# EAGLE design board (EAGLE 5.06)
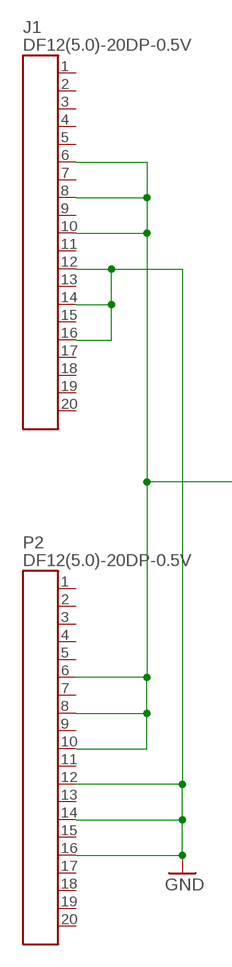
[diagram p0: schematic, sheet 1, part 1 of 2]
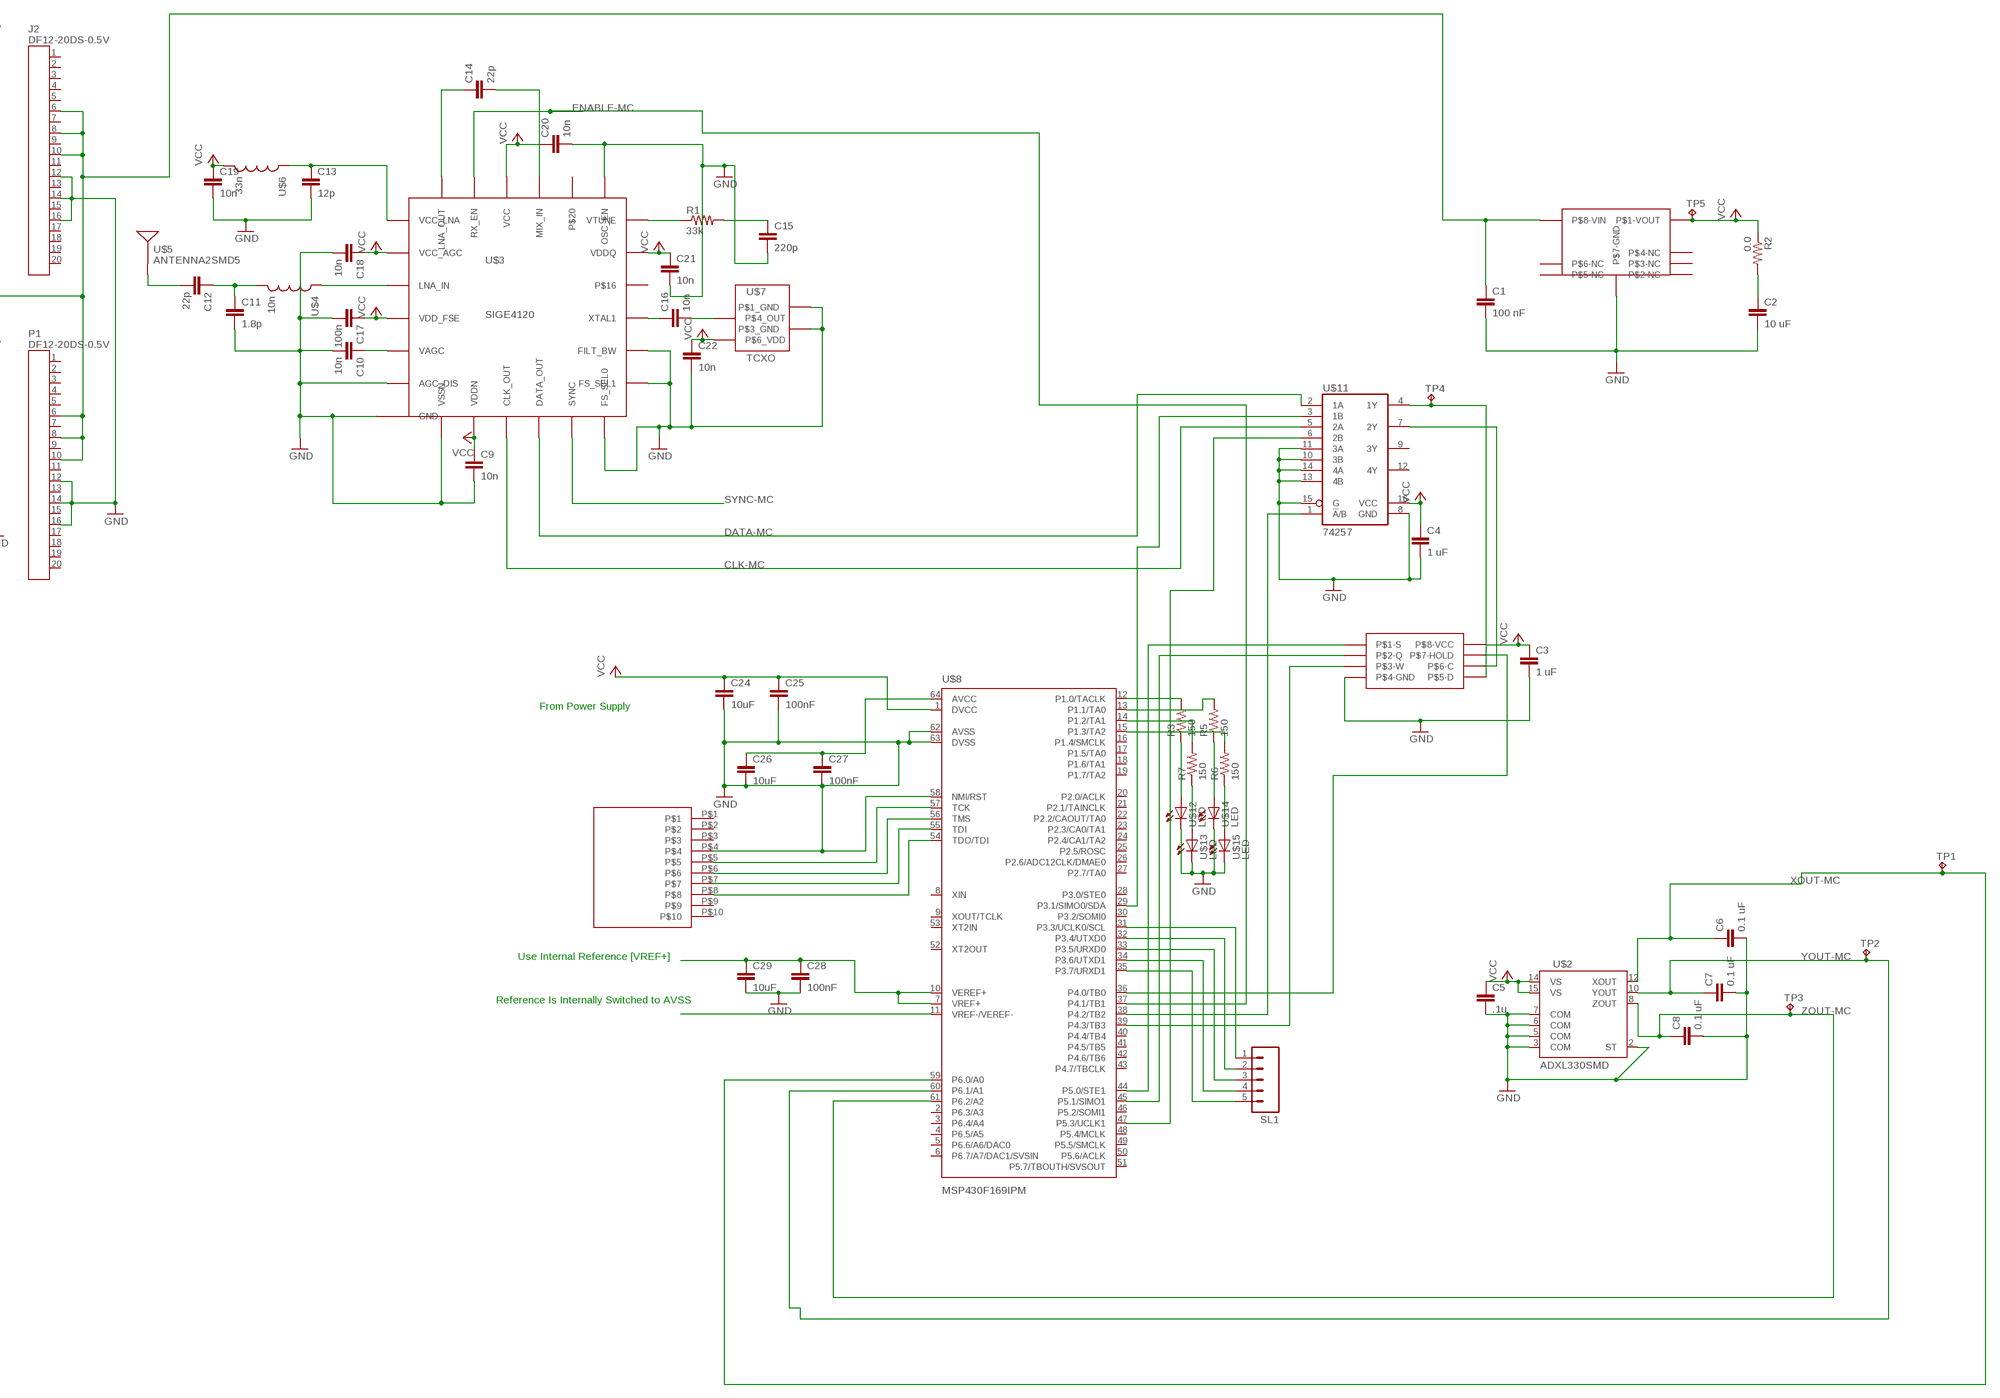
[diagram p1: schematic, sheet 1, part 2 of 2]

## Parts
C1  100 nF  CAP0402  [C0402]
C2  10 uF  CAP0402  [C0402]
C3  1 uF  CAP0402  [C0402]
C4  1 uF  CAP0402  [C0402]
C5  .1u  CAP0402  [C0402]
C6  0.1 uF  CAP0402  [C0402]
C7  0.1 uF  CAP0402  [C0402]
C8  0.1 uF  CAP0402  [C0402]
C9  10n  CAP0402  [C0402]
C10  10n  CAP0402  [C0402]
C11  1.8p  CAP0402  [C0402]
C12  22p  CAP0402  [C0402]
C13  12p  CAP0402  [C0402]
C14  22p  CAP0402  [C0402]
C15  220p  CAP0402  [C0402]
C16  10n  CAP0402  [C0402]
C17  100n  CAP0402  [C0402]
C18  10n  CAP0402  [C0402]
C19  10n  CAP0402  [C0402]
C20  10n  CAP0402  [C0402]
C21  10n  CAP0402  [C0402]
C22  10n  CAP0402  [C0402]
C24  10uF  CAP0402  [C0402]
C25  100nF  CAP0402  [C0402]
C26  10uF  CAP0402  [C0402]
C27  100nF  CAP0402  [C0402]
C28  100nF  CAP0402  [C0402]
C29  10uF  CAP0402  [C0402]
J1  DF12(5.0)-20DP-0.5V  [DF12(XX)-20DP-0.5V]
J2  DF12-20DS-0.5V  [DF12-20DS-0.5V]
P1  DF12-20DS-0.5V  [DF12-20DS-0.5V]
P2  DF12(5.0)-20DP-0.5V  [DF12(XX)-20DP-0.5V]
R1  33k  RESISTOR0402  [C0402]
R2  0.0  RESISTOR  [0805]
R3  150  RESISTOR0402  [C0402]
R5  150  RESISTOR0402  [C0402]
R6  150  RESISTOR0402  [C0402]
R7  150  RESISTOR0402  [C0402]
SL1  M05  [1X05]
TP1  TPTP09SQ  [TP09SQ]
TP2  TPTP09SQ  [TP09SQ]
TP3  TPTP09SQ  [TP09SQ]
TP4  TPTP09SQ  [TP09SQ]
TP5  TPTP09SQ  [TP09SQ]
U$1  FH12A-10S-0.5SH(55)  [FH12A-10S-0.5SH(55)]
U$2  ADXL330SMD  [LFCSP-16]
U$3  SIGE4120  [SIGE4120]
U$4  10n  INDUCTOR0402  [C0402]
U$5  ANTENNA2SMD5  [ANTENNA-CHIP5]
U$6  33n  INDUCTOR0402  [C0402]
U$7  TCXO  [TXCO]
U$8  MSP430F169IPM  [S-PQFP64-G64]
U$9  M25P128  [VDFPN8]
U$10  LM2936  [8-SOIC]
U$11  74257  [16]
U$12  LED  [LED0402]
U$13  LED  [LED0402]
U$14  LED  [LED0402]
U$15  LED  [LED0402]

## Nets
CLK-MC: U$3.CLK_OUT U$11.5(2A)
DATA-MC: U$3.DATA_OUT U$11.2(1A)
ENABLE-MC: U$3.RX_EN U$8.37(P4.1/TB1)
GND: C1.2 C2.2 C3.2 C4.2 C5.2 C6.2 C7.2 C8.2 C9.2 C10.2 C11.2 C13.2 C15.2 C17.2 C18.2 C19.2 C20.2 C21.2 C22.2 C24.2 C25.2 C26.2 C27.2 C28.2 C29.2 J1.12 J1.14 J1.16 J2.12 J2.14 J2.16 P1.12 P1.14 P1.16 P2.12 P2.14 P2.16 U$1.P$4 U$2.2(ST) U$2.3(COM) U$2.5(COM) U$2.6(COM) U$2.7(COM) U$3.AGC_DIS U$3.FILT_BW U$3.FS_SEL0 U$3.FS_SEL1 U$3.GND U$3.OSC_EN U$3.VSSN U$7.P$1_GND U$7.P$3_GND U$8.58(NMI/RST) U$8.62(AVSS) U$8.63(DVSS) U$9.P$4(P$4-GND) U$10.P$7-GND U$11.8(GND) U$11.10(3B) U$11.11(3A) U$11.13(4B) U$11.14(4A) U$11.15(G) U$12.P$2 U$13.P$2 U$14.P$2 U$15.P$2
N$1: U$8.36(P4.0/TB0) U$9.P$7(P$7-HOLD)
N$2: C28.1 C29.1 U$8.7(VREF+) U$8.10(VEREF+)
N$3: U$1.P$8 U$8.54(TDO/TDI)
N$4: SL1.1 U$8.31(P3.3/UCLK0/SCL)
N$5: C10.1 U$3.VAGC
N$6: SL1.2 U$8.32(P3.4/UTXD0)
N$7: U$3.LNA_IN U$4.1
N$8: C11.1 C12.1 U$4.2
N$9: C12.2 U$5.FEED(SIGNAL)
N$10: C13.1 U$3.VCC_LNA U$6.1
N$11: C14.1 U$3.LNA_OUT
N$12: C14.2 U$3.MIX_IN
N$13: R1.1 U$3.VTUNE
N$14: C15.1 R1.2
N$15: C16.1 U$3.XTAL1
N$16: C16.2 U$7.P$4_OUTPUT(P$4_OUT)
N$17: C1.1 J1.6 J1.8 J1.10 J2.6 J2.8 J2.10 P1.6 P1.8 P1.10 P2.6 P2.8 P2.10 U$10.P$8-VIN
N$18: C2.1 R2.2
N$19: U$8.11(VREF-/VEREF-)
N$20: SL1.3 U$8.33(P3.5/URXD0)
N$21: C26.1 C27.1 U$8.64(AVCC)
N$22: SL1.4 U$8.34(P3.6/UTXD1)
N$23: SL1.5 U$8.35(P3.7/URXD1)
N$24: U$8.45(P5.1/SIMO1) U$9.P$2(P$2-Q)
N$25: U$8.44(P5.0/STE1) U$9.P$1(P$1-S)
N$26: U$8.38(P4.2/TB2) U$11.1(!A!/B)
N$27: U$9.P$6(P$6-C) U$11.7(2Y)
N$28: TP4.TP U$9.P$5(P$5-D) U$11.4(1Y)
N$29: U$8.47(P5.3/UCLK1) U$11.6(2B)
N$30: U$8.29(P3.1/SIMO0/SDA) U$11.3(1B)
N$31: U$1.P$7 U$8.55(TDI)
N$32: U$1.P$6 U$8.56(TMS)
N$33: U$1.P$5 U$8.57(TCK)
N$34: U$8.39(P4.3/TB3) U$9.P$3(P$3-W)
N$35: R3.2 U$8.12(P1.0/TACLK)
N$37: R3.1 U$12.P$1
N$38: R5.2 U$8.13(P1.1/TA0)
N$39: R5.1 U$14.P$1
N$40: R7.2 U$8.14(P1.2/TA1)
N$41: R7.1 U$13.P$1
N$42: R6.2 U$8.15(P1.3/TA2)
N$43: R6.1 U$15.P$1
SYNC-MC: U$3.SYNC
VCC: C3.1 C4.1 C5.1 C9.1 C17.1 C18.1 C19.1 C20.1 C21.1 C22.1 C24.1 C25.1 R2.1 TP5.TP U$2.14(VS) U$2.15(VS) U$3.VCC U$3.VCC_AGC U$3.VDD_FSE U$3.VDDN U$3.VDDQ U$6.2 U$7.P$6_VDD U$8.1(DVCC) U$9.P$8(P$8-VCC) U$10.P$1-VOUT U$11.16(VCC)
XOUT-MC: C6.1 TP1.TP U$2.12(XOUT) U$8.59(P6.0/A0)
YOUT-MC: C7.1 TP2.TP U$2.10(YOUT) U$8.60(P6.1/A1)
ZOUT-MC: C8.1 TP3.TP U$2.8(ZOUT) U$8.61(P6.2/A2)
Unconnected: J1.1 J1.2 J1.3 J1.4 J1.5 J1.7 J1.9 J1.11 J1.13 J1.15 J1.17 J1.18 J1.19 J1.20 J2.1 J2.2 J2.3 J2.4 J2.5 J2.7 J2.9 J2.11 J2.13 J2.15 J2.17 J2.18 J2.19 J2.20 P1.1 P1.2 P1.3 P1.4 P1.5 P1.7 P1.9 P1.11 P1.13 P1.15 P1.17 P1.18 P1.19 P1.20 P2.1 P2.2 P2.3 P2.4 P2.5 P2.7 P2.9 P2.11 P2.13 P2.15 P2.17 P2.18 P2.19 P2.20 U$1.P$1 U$1.P$2 U$1.P$3 U$1.P$9 U$1.P$10 U$3.P$16 U$3.P$20 U$8.2(P6.3/A3) U$8.3(P6.4/A4) U$8.4(P6.5/A5) U$8.5(P6.6/A6/DAC0) U$8.6(P6.7/A7/DAC1/SVSIN) U$8.8(XIN) U$8.9(XOUT/TCLK) U$8.16(P1.4/SMCLK) U$8.17(P1.5/TA0) U$8.18(P1.6/TA1) U$8.19(P1.7/TA2) U$8.20(P2.0/ACLK) U$8.21(P2.1/TAINCLK) U$8.22(P2.2/CAOUT/TA0) U$8.23(P2.3/CA0/TA1) U$8.24(P2.4/CA1/TA2) U$8.25(P2.5/ROSC) U$8.26(P2.6/ADC12CLK/DMAE0) U$8.27(P2.7/TA0) U$8.28(P3.0/STE0) U$8.30(P3.2/SOMI0) U$8.40(P4.4/TB4) U$8.41(P4.5/TB5) U$8.42(P4.6/TB6) U$8.43(P4.7/TBCLK) U$8.46(P5.2/SOMI1) U$8.48(P5.4/MCLK) U$8.49(P5.5/SMCLK) U$8.50(P5.6/ACLK) U$8.51(P5.7/TBOUTH/SVSOUT) U$8.52(XT2OUT) U$8.53(XT2IN) U$10.P$2-NC U$10.P$3-NC U$10.P$4-NC U$10.P$5-NC U$10.P$6-NC U$11.9(3Y) U$11.12(4Y)

## Notes on the sheet
- From Power Supply
- Use Internal Reference [VREF+]
- Reference Is Internally Switched to AVSS

## Library data of the parts
C1-C22 C24-C29 = SparkFun:CAP: Capacitor Standard 0603 ceramic capacitor, and 0.1" leaded capacitor.
J1 P2 = Hirose Connectors:DF12(5.0)-20DP-0.5V: Connector, Header, board-board, 20-pin. Dual Row, 5mm stack height, 0.5mm Pitch (Hirose)
J2 P1 = Hirose Connectors:DF12-20DS-0.5V: Connector, Receptacle, board-board, 20-pin. Dual Row, 3.5 to 5mm stack height, 0.5mm Pitch (Hirose)
R1-R3 R5-R7 = SparkFun:RESISTOR: Resistor Basic schematic elements and footprints for 0603, 1206, and PTH 1/10th watt (small) resistors.
SL1 = SparkFun-3-2-07:M05: Header 5 Standard 5-pin 0.1" header. Use with straight break away headers (SKU : PType-HD), right angle break away headers (PType-HD-RightAngle), swiss pins (PType-30F), machine pins (PType-MP), and female headers (PType-FH). Molex polarized connector foot print use with SKU : Con-Hdr with associated crimp pins and housings.
TP1-TP5 = testpad:TP: Test pad
U$1 = mylib:FH12A-10S-0.5SH(55)
U$2 = SparkFun:ADXL330: Triple Axis Accelerometer Analog Devices ADXL330 +/-3g 2.4V-5.25V Analog output. Spark Fun Electronics SKU : COM-00730. Center pad paste layer has been reduced to avoid shorting.
U$3 = mylib:SIGE4120
U$4 U$6 = SparkFun:INDUCTOR: Inductors Basic Inductor/Choke - 0603 and 1206. Footprints are not proven and vary greatly between part numbers.
U$5 = SparkFun:ANTENNA2: Antenna Single endded antenna. Common with smaller chip antennas. CHIP4 package is the GPS Chip Antenna SKU: GPS-08418. CHIP5 package is 2.4GHz chip antenna SKU: WRL-00144.
U$7 = mylib:TCXO
U$8 = msp430:MSP430F16*: Mixed Signal Microcontroller 12bit ADC, 12bit DAC, I²C, USART, no LCD
U$9 = mylib:M25P128
U$10 = lm2936a:LM2936
U$11 = mylib:74257
U$12-U$15 = mylib:LED

## Board
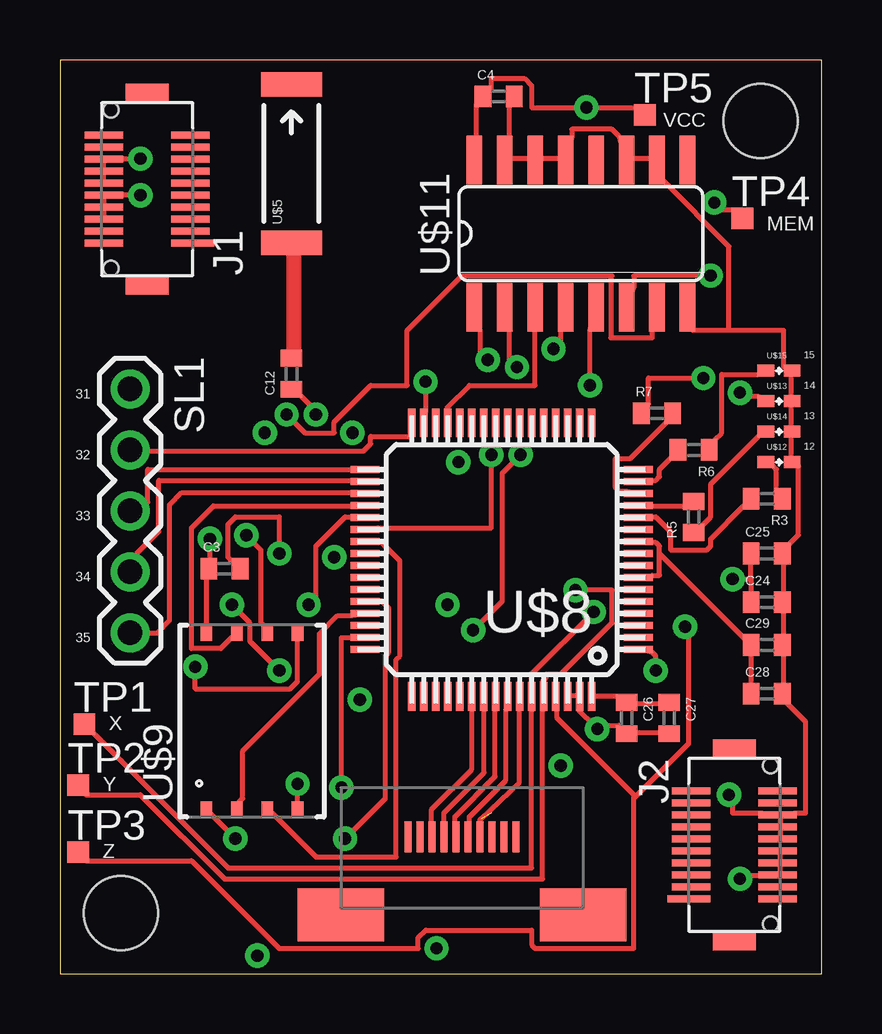
[diagram p2: board, top side]
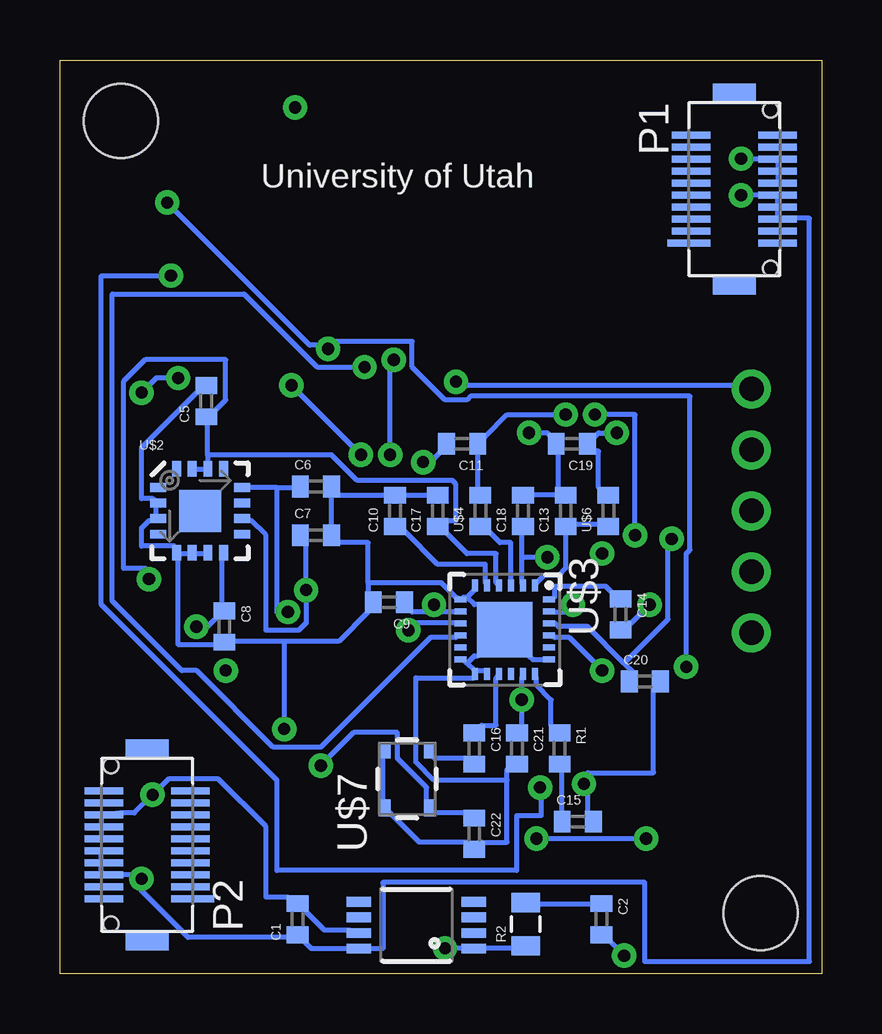
[diagram p3: board, bottom side, seen from below]

Size 31.75 x 38.1 mm. Coordinates in mm from the lower left corner, seen from the top.
Outline: 0,0 31.75,0 31.75,38.1 0,38.1 0,0
Copper layers ((1*2)+(15*16)): Top 0.035mm / dielectric 1.5mm / $gnd 0.035mm / dielectric 0.15mm / $vcc 0.035mm / dielectric 0.2mm / Bottom 0.035mm
Design rules "SparkFun *": minimum track width 8mil, minimum drill 20mil, track to track 6mil, track to pad 6mil, pad to pad 6mil, via to via 6mil, smd to smd 6mil, copper to edge 10mil, drill to drill 8mil, minimum pad ring 12mil, minimum via ring 10mil, stop-mask expansion 4mil, vias tented up to drill 25mil, thermal gap 10mil
Holes 3.1 mm at 2.54,2.54 29.21,35.56
tRestrict: 4 lines
bRestrict: 4 lines

### Footprints (pad centres in the part's own frame; a part is rotated, then mirrored left to right if it is on the bottom)
C0402 = smd 0.7 x 0.9: 1 -0.65,0; 2 0.65,0
DF12(XX)-20DP-0.5V = smd 0.3 x 1.8: 1 -2.25,-1.9 | smd 0.3 x 1.6: 2 -2.25,1.8; 3 -1.75,-1.8; 4 -1.75,1.8; 5 -1.25,-1.8; 6 -1.25,1.8; 7 -0.75,-1.8; 8 -0.75,1.8; 9 -0.25,-1.8; 10 -0.25,1.8; 11 0.25,-1.8; 12 0.25,1.8; 13 0.75,-1.8; 14 0.75,1.8; 15 1.25,-1.8; 16 1.25,1.8; 17 1.75,-1.8; 18 1.75,1.8; 19 2.25,-1.8; 20 2.25,1.8 | smd 0.8 x 1.8: T1 4,0; T2 -4,0 | hole 0.635: 3.3,1.5; -3.3,1.5
DF12-20DS-0.5V = smd 0.3 x 1.8: 1 2.25,-1.9 | smd 0.3 x 1.6: 2 2.25,1.8; 3 1.75,-1.8; 4 1.75,1.8; 5 1.25,-1.8; 6 1.25,1.8; 7 0.75,-1.8; 8 0.75,1.8; 9 0.25,-1.8; 10 0.25,1.8; 11 -0.25,-1.8; 12 -0.25,1.8; 13 -0.75,-1.8; 14 -0.75,1.8; 15 -1.25,-1.8; 16 -1.25,1.8; 17 -1.75,-1.8; 18 -1.75,1.8; 19 -2.25,-1.8; 20 -2.25,1.8 | smd 0.8 x 1.8: T1 4,0; T2 -4,0 | hole 0.635: 3.3,1.5; -3.3,1.5
0805 = smd 0.8 x 1.2: 1 -0.9,0; 2 0.9,0
1X05 = drill 1.016 round: 1 0,0; 2 2.54,0; 3 5.08,0; 4 7.62,0; 5 10.16,0
TP09SQ = smd 0.9 x 0.9: TP 0,0
FH12A-10S-0.5SH(55) = smd 0.3 x 1.3: P$1 -2.25,0; P$2 -1.75,0; P$3 -1.25,0; P$4 -0.75,0; P$5 -0.25,0; P$6 0.25,0; P$7 0.75,0; P$8 1.25,0; P$9 1.75,0; P$10 2.25,0 | smd 3.6 x 2.2: P$11 -5.05,3.25; P$12 5.05,3.25
LFCSP-16 = smd 1.75 x 1.75: 0 0,0 | smd 0.65 x 0.37: 1 -1.75,0.975; 2 -1.75,0.325; 3 -1.75,-0.325; 4 -1.75,-0.975; 9 1.75,-0.975; 10 1.75,-0.325; 11 1.75,0.325; 12 1.75,0.975 | smd 0.37 x 0.65: 5 -0.975,-1.75; 6 -0.325,-1.75; 7 0.325,-1.75; 8 0.975,-1.75; 13 0.975,1.75; 14 0.325,1.75; 15 -0.325,1.75; 16 -0.975,1.75
SIGE4120 = smd 0.5 x 0.25: AGC_DIS -1.85,-1.25; FILT_BW 1.85,-0.75; FS_SEL1 1.85,-1.25; LNA_IN -1.85,0.25; P$16 1.85,0.25; VAGC -1.85,-0.75; VCC_AGC -1.85,0.75; VCC_LNA -1.85,1.25; VDD_FSE -1.85,-0.25; VDDQ 1.85,0.75; VTUNE 1.85,1.25; XTAL1 1.85,-0.25 | smd 0.25 x 0.5: CLK_OUT -0.25,-1.85; DATA_OUT 0.25,-1.85; FS_SEL0 1.25,-1.85; LNA_OUT -1.25,1.85; MIX_IN 0.25,1.85; OSC_EN 1.25,1.85; P$20 0.75,1.85; RX_EN -0.75,1.85; SYNC 0.75,-1.85; VCC -0.25,1.85; VDDN -0.75,-1.85; VSSN -1.25,-1.85 | smd 2.3 x 2.3: GND 0,0
ANTENNA-CHIP5 = smd 1.016 x 2.54: FEED -3.302,0; NC 3.302,0
TXCO = smd 0.7 x 0.5: P$1_GND -1.2,0.95; P$3_GND 1.2,0.95; P$4_OUTPUT 1.2,-0.95; P$6_VDD -1.2,-0.95
S-PQFP64-G64 = smd 1.2 x 0.3: 1 -5.7,3.75; 2 -5.7,3.25; 3 -5.7,2.75; 4 -5.7,2.25; 5 -5.7,1.75; 6 -5.7,1.25; 7 -5.7,0.75; 8 -5.7,0.25; 9 -5.7,-0.25; 10 -5.7,-0.75; 11 -5.7,-1.25; 12 -5.7,-1.75; 13 -5.7,-2.25; 14 -5.7,-2.75; 15 -5.7,-3.25; 16 -5.7,-3.75; 33 5.7,-3.75; 34 5.7,-3.25; 35 5.7,-2.75; 36 5.7,-2.25; 37 5.7,-1.75; 38 5.7,-1.25; 39 5.7,-0.75; 40 5.7,-0.25; 41 5.7,0.25; 42 5.7,0.75; 43 5.7,1.25; 44 5.7,1.75; 45 5.7,2.25; 46 5.7,2.75; 47 5.7,3.25; 48 5.7,3.75 | smd 0.3 x 1.2: 17 -3.75,-5.7; 18 -3.25,-5.7; 19 -2.75,-5.7; 20 -2.25,-5.7; 21 -1.75,-5.7; 22 -1.25,-5.7; 23 -0.75,-5.7; 24 -0.25,-5.7; 25 0.25,-5.7; 26 0.75,-5.7; 27 1.25,-5.7; 28 1.75,-5.7; 29 2.25,-5.7; 30 2.75,-5.7; 31 3.25,-5.7; 32 3.75,-5.7; 49 3.75,5.7; 50 3.25,5.7; 51 2.75,5.7; 52 2.25,5.7; 53 1.75,5.7; 54 1.25,5.7; 55 0.75,5.7; 56 0.25,5.7; 57 -0.25,5.7; 58 -0.75,5.7; 59 -1.25,5.7; 60 -1.75,5.7; 61 -2.25,5.7; 62 -2.75,5.7; 63 -3.25,5.7; 64 -3.75,5.7
VDFPN8 = smd 0.6 x 0.48: P$1 -3.65,1.905; P$2 -3.65,0.635; P$3 -3.65,-0.635; P$4 -3.65,-1.905; P$5 3.65,-1.905; P$6 3.65,-0.635; P$7 3.65,0.635; P$8 3.65,1.905
8-SOIC = smd 0.41 x 1.02: P$1-VOUT -0.975,-2.4; P$2-NC -0.325,-2.4; P$3-NC 0.325,-2.4; P$4-NC 0.975,-2.4; P$5-NC 0.975,2.4; P$6-NC 0.325,2.4; P$7-GND -0.325,2.4; P$8-VIN -0.975,2.4
16 = smd 0.66 x 2.032: 1 -4.445,-3.073; 2 -3.175,-3.073; 3 -1.905,-3.073; 4 -0.635,-3.073; 5 0.635,-3.073; 6 1.905,-3.073; 7 3.175,-3.073; 8 4.445,-3.073; 9 4.445,3.073; 10 3.175,3.073; 11 1.905,3.073; 12 0.635,3.073; 13 -0.635,3.073; 14 -1.905,3.073; 15 -3.175,3.073; 16 -4.445,3.073
LED0402 = smd 0.7 x 0.5: P$1 -0.55,0; P$2 0.55,0

### Placement (x,y rotation side)
C1  21.84,2.29 90 bottom
C2  9.18,2.29 270 bottom
C3  6.86,16.89 0 top
C4  18.29,36.58 0 top
C5  25.65,23.88 90 bottom
C6  21.08,20.32 0 bottom
C7  21.08,18.29 0 bottom
C8  24.89,14.48 270 bottom
C9  18.03,15.49 180 bottom
C10  17.78,19.3 90 bottom
C11  14.99,22.1 180 bottom
C12  9.65,25.02 90 top
C13  10.67,19.3 90 bottom
C14  8.38,14.99 270 bottom
C15  10.16,6.35 0 bottom
C16  14.48,9.4 270 bottom
C17  16,19.3 90 bottom
C18  12.45,19.3 90 bottom
C19  10.41,22.1 180 bottom
C20  7.37,12.19 0 bottom
C21  12.7,9.4 270 bottom
C22  14.48,5.84 270 bottom
C24  29.46,15.49 0 top
C25  29.46,17.53 0 top
C26  23.62,10.67 270 top
C27  25.4,10.67 270 top
C28  29.46,11.68 0 top
C29  29.46,13.72 0 top
J1  3.63,32.72 90 top
J2  28.12,5.38 270 top
P1  3.63,32.72 270 bottom
P2  28.12,5.38 90 bottom
R1  10.92,9.4 270 bottom
R2  12.33,2.08 90 bottom
R3  29.46,19.81 180 top
R5  26.42,19.05 90 top
R6  26.42,21.84 180 top
R7  24.89,23.37 0 top
SL1  2.92,24.38 270 top
TP1  1.02,10.41 0 top
TP2  0.76,7.87 0 top
TP3  0.76,5.08 0 top
TP4  28.45,31.5 0 top
TP5  24.38,35.81 0 top
U$1  16.76,5.71 180 top
U$2  25.91,19.3 0 bottom
U$3  13.21,14.35 270 bottom
U$4  14.22,19.3 90 bottom
U$5  9.65,33.78 90 top
U$6  8.89,19.3 90 bottom
U$7  17.27,8.13 90 bottom
U$8  18.41,17.27 180 top
U$9  8,10.54 90 top
U$10  16.89,2.03 90 bottom
U$11  21.72,30.86 0 top
U$12  29.97,21.34 0 top
U$13  29.97,23.88 0 top
U$14  29.97,22.61 0 top
U$15  29.97,25.15 0 top

### Tracks (layer width: path | path; a pad name or v marks a point on that pad's centre or on a via)
CLK-MC  (via drill 0.51)
  Top 0.203: v17.22,14.33 18.44,15.54 18.44,20.88 v19.2,21.64 | v22.1,24.54 22.1,26.82 U$11.5
  Bottom 0.203: v17.22,14.33 16.92,14.63 15.24,14.63 U$3.CLK_OUT | v19.2,21.64 v22.1,24.54
DATA-MC  (via drill 0.51)
  Top 0.203: v19.05,25.3 18.75,25.6 18.75,26.82 U$11.2
  Bottom 0.203: v19.05,25.3 21.03,25.3 24.08,28.35 29.57,28.35 29.57,15.54 26.67,12.65 26.06,12.65 22.86,9.45 20.88,9.45 16.31,14.02 15.24,14.02 U$3.DATA_OUT
ENABLE-MC  (via drill 0.51)
  Top 0.203: v10.36,15.39 10.67,15.7 10.67,17.83 11.89,19.05 12.19,19.05 U$8.37
  Bottom 0.203: U$3.RX_EN 11.12,15.09 10.36,15.09 v10.36,15.39
GND  (via drill 0.51)  (1 unrouted)
  Top 0.203: C4.2 18.75,36.27 18.75,34.9 U$11.15 18.75,33.98 19.51,33.98 U$11.14 20.12,33.98 20.88,33.98 U$11.13 21.34,34.9 21.34,35.2 23.01,35.2 23.32,34.9 U$11.11 23.93,33.98 24.69,33.98 U$11.10 25.15,33.07 27.89,30.33 27.89,26.82 | P2.12 30.02,5.64 30.02,6.1 P2.14 30.02,6.25 30.02,6.55 P2.16 | P2.16 30.63,6.71 31.09,6.71 31.09,10.52 30.33,11.28 C28.2 30.18,12.04 30.18,13.41 C29.2 30.18,14.02 30.18,15.09 C24.2 30.18,15.85 30.18,17.22 C25.2 30.33,17.83 30.79,18.29 30.79,21.18 U$12.P$2 30.48,21.49 30.48,22.4 U$14.P$2 30.48,22.71 30.48,23.77 U$13.P$2 30.48,24.08 30.48,24.99 U$15.P$2 30.18,25.3 30.18,26.82 27.89,26.82 | 27.89,26.82 26.36,26.82 U$11.8 | U$8.62 21.18,11.58 21.64,11.58 U$8.63 21.64,10.97 22.25,10.36 22.4,10.36 | C27.2 24.99,10.06 23.93,10.06 C26.2 23.32,10.36 22.4,10.36 | J1.12 1.83,33.07 1.83,33.38 J1.14 1.83,33.53 1.83,33.83 J1.16 2.59,33.98 v3.35,33.98 | U$9.P$4 v9.91,7.92 | v9.14,17.53 9.14,19.05 7.32,19.05 7.01,18.75 7.01,17.37 7.16,17.22 C3.2 | v22.4,10.21 22.4,10.36 | P2.16 29.26,6.71 28.04,6.71 28.04,7.01 v27.89,7.47 | U$1.P$4 17.51,6.44 17.53,6.45 19.15,7.98 U$8.58
  Bottom 0.203: U$7.P$3_GND 18.29,8.99 18.29,7.16 U$7.P$1_GND 17.98,6.71 16.76,5.49 14.78,5.49 C22.2 14.17,5.49 13.11,5.49 13.11,8.08 | 13.11,8.08 13.11,8.53 C21.2 | U$2.7 25.76,17.53 26.06,17.53 U$2.6 26.36,17.53 26.82,17.53 U$2.5 | U$2.5 26.98,17.83 28.35,17.83 28.35,18.59 28.04,18.9 27.89,18.9 U$2.3 27.74,19.05 27.74,19.51 U$2.2 27.89,19.81 28.35,19.81 28.35,21.95 26.06,24.23 C5.2 | 14.48,12.65 14.02,12.65 U$3.FILT_BW | 14.48,12.65 14.78,12.95 | 14.78,12.95 14.94,13.11 U$3.FS_SEL0 | 14.48,12.65 U$3.FS_SEL1 14.48,12.34 16.92,12.34 16.92,8.84 16.15,8.08 13.11,8.08 | 14.78,15.7 14.48,16 U$3.AGC_DIS | 14.78,15.7 14.94,15.7 U$3.VSSN 15.24,15.7 15.85,16.31 18.9,16.31 | U$3.OSC_EN 11.58,13.11 12.04,13.11 12.19,13.26 U$3.GND | 14.78,15.7 14.48,15.39 14.33,15.39 U$3.GND | 14.78,12.95 14.48,13.26 14.33,13.26 U$3.GND | C17.2 16.31,19.96 17.37,19.96 C10.2 18.14,19.96 20.12,19.96 C6.2 20.42,19.96 20.42,18.59 C7.2 20.12,17.98 18.9,17.98 18.9,16.31 | 18.9,16.31 18.9,15.85 C9.2 18.9,15.09 20.12,13.87 22.4,13.87 | 22.4,13.87 24.54,13.87 C8.2 25.3,13.72 26.82,13.72 26.82,17.37 U$2.5 | P2.12 30.02,5.64 30.02,6.1 P2.14 30.02,6.25 30.02,6.55 P2.16 29.26,6.71 28.65,6.71 v27.89,7.47 27.23,8.13 25.15,8.13 23.16,6.15 23.16,3.2 22.25,3.2 C1.2 21.49,2.59 20.73,1.83 19.66,1.83 U$10.P$7-GND | C18.2 12.04,19.96 10.97,19.96 C13.2 10.97,20.27 10.97,21.79 C19.2 11.28,22.4 11.43,22.55 v12.19,22.55 | J1.12 1.83,33.07 1.83,33.38 J1.14 1.83,33.53 1.83,33.83 J1.16 2.59,33.98 v3.35,33.98 | v8.23,0.76 8.84,1.37 C2.2 | C15.2 9.75,6.71 9.75,7.47 v9.91,7.92 9.75,8.38 7.01,8.38 7.01,11.89 C20.2
  Bottom 0.203: v16.61,21.34 16.31,21.34 15.85,21.79 C11.2 | 22.4,13.87 v22.4,10.21
N$1
  Top 0.203: U$9.P$7 7.16,14.02 6.71,13.56 5.49,13.56 5.49,18.59 6.4,19.51 12.19,19.51 U$8.36
N$2
  Top 0.203: C28.1 28.8,12.04 28.8,13.41 C29.1 28.5,14.02 24.99,17.53 | 24.99,17.53 24.99,17.83 24.84,17.98 24.69,17.98 U$8.10 | 24.99,17.53 24.99,16.61 24.69,16.61 U$8.7
N$3
  Top 0.203: U$8.54 17.17,8.53 15.49,6.86 15.49,5.74 U$1.P$8
N$4  (via drill 0.51)
  Top 0.203: v15.24,24.69 15.24,23.47 U$8.31
  Bottom 0.203: v15.24,24.69 15.09,24.54 3.66,24.54 SL1.1
N$5
  Bottom 0.203: U$3.VAGC 14.02,16.31 14.02,17.07 16,17.07 17.37,18.44 C10.1
N$6
  Top 0.203: U$8.32 14.63,22.4 12.95,22.4 12.95,22.1 12.65,21.79 3.66,21.79 SL1.2
N$7
  Bottom 0.203: U$3.LNA_IN 12.95,16.31 12.95,17.98 13.41,17.98 13.87,18.44 U$4.1
N$8  (via drill 0.51)
  Top 0.203: v10.67,23.32 10.67,23.47 10.06,24.08 C12.1
  Bottom 0.203: U$4.2 14.33,20.27 14.33,21.79 C11.1 14.02,22.4 13.11,23.32 v10.67,23.32
N$9
  Top 0.203: C12.2 9.75,25.91 | 9.75,30.02 U$5.FEED
  Top 0.616: 9.75,25.91 9.75,30.02
N$10
  Bottom 0.203: U$3.VCC_LNA 11.89,16.31 11.58,16.61 10.97,16.61 10.67,16.92 C13.1 10.36,18.75 9.3,18.75 U$6.1
N$11
  Bottom 0.203: U$3.LNA_OUT 11.12,15.7 11.12,16.15 8.99,16.15 8.69,15.85 C14.1
N$12  (via drill 0.51)
  Top 0.203: v9.14,12.65 7.92,13.87 7.92,14.63 v7.16,15.39
  Bottom 0.203: v9.14,12.65 10.52,14.02 11.12,14.02 U$3.MIX_IN | v7.16,15.39 7.92,14.63 8.08,14.63 C14.2
N$13
  Bottom 0.203: U$3.VTUNE 11.89,12.34 11.89,12.04 11.28,11.43 11.28,10.36 R1.1
N$14
  Bottom 0.203: C15.1 10.82,6.71 10.82,8.53 R1.2
N$15
  Bottom 0.203: U$3.XTAL1 13.56,12.34 13.56,10.36 14.17,10.36 C16.1
N$16
  Bottom 0.203: U$7.P$4_OUTPUT 16.15,8.99 14.78,8.99 C16.2
N$17  (via drill 0.51)
  Top 0.203: J2.10 30.02,5.03 30.02,4.72 J2.8 30.02,4.57 30.02,4.27 J2.6 29.26,4.12 28.35,4.12 v28.35,3.96 | P1.6 1.83,31.55 1.83,31.85 P1.8 1.83,32 P1.10 2.59,32.46 v3.35,32.46
  Bottom 0.203: J2.10 30.02,5.03 30.02,4.72 J2.8 30.02,4.57 30.02,4.27 J2.6 28.52,4.13 v28.35,3.96 28.35,3.45 26.42,1.52 21.96,1.52 C1.1 21.27,1.06 U$10.P$8-VIN 18.29,1.06 18.29,3.81 7.37,3.81 7.37,0.51 0.51,0.51 0.51,31.5 1.83,31.5 P1.6 1.83,31.55 1.83,31.85 P1.8 1.83,32 P1.10 2.59,32.46 v3.35,32.46
N$18
  Bottom 0.203: C2.1 9.6,2.9 11.73,2.9 R2.2
N$20
  Top 0.203: U$8.33 12.19,21.03 3.66,21.03 3.66,19.66 SL1.3
N$21
  Top 0.203: C27.1 24.99,11.28 23.93,11.28 C26.1 23.32,11.58 22.25,11.58 U$8.64
N$22
  Top 0.203: U$8.34 12.19,20.57 4.12,20.57 4.12,18.44 3.2,17.53 SL1.4
N$23
  Top 0.203: U$8.35 12.67,20.07 5.08,20.07 4.57,19.56 4.57,14.73 4.06,14.22 SL1.5
N$24
  Top 0.203: U$9.P$2 7.47,7.16 7.62,7.32 7.62,9.3 10.82,12.5 10.82,14.17 11.58,14.94 12.19,14.94 U$8.45
N$25  (via drill 0.51)
  Top 0.203: v7.32,5.64 6.25,6.71 U$9.P$1 | v11.89,5.64 13.56,7.32 13.56,13.26 13.72,13.41 13.72,15.24 13.41,15.54 13.26,15.54 U$8.44
  Bottom 0.203: v7.32,5.64 v11.89,5.64
N$26  (via drill 0.51)
  Top 0.203: v17.98,21.64 17.98,18.59 13.26,18.59 U$8.38 | v17.83,25.6 17.53,25.91 17.53,26.82 U$11.1
  Bottom 0.203: v17.98,21.64 17.98,25.6 v17.83,25.6
N$27  (via drill 0.51)
  Top 0.203: v7.77,18.29 8.38,17.68 8.38,14.63 8.53,14.48 U$9.P$6 | v9.45,23.32 10.21,22.55 11.43,22.55 11.43,23.01 12.95,24.54 14.48,24.54 14.48,26.82 16.76,29.11 22.96,29.11 | U$11.7 24.69,26.82 24.69,26.52 22.96,26.52 22.96,29.11 | 22.96,29.11 23.01,29.11
  Bottom 0.203: v7.77,18.29 7.77,23.32 v9.45,23.32
N$28  (via drill 0.51)
  Top 0.203: v5.64,12.8 5.64,11.89 9.6,11.89 9.91,12.19 U$9.P$5 | v20.57,26.06 20.88,26.36 20.88,26.82 U$11.4 | v27.28,32.16 27.28,31.85 28.04,31.85 TP4.TP
  Bottom 0.203: v5.64,12.8 5.64,17.53 5.49,17.68 5.49,24.08 14.63,24.08 14.78,23.93 15.7,23.93 17.07,25.3 17.07,26.36 20.27,26.36 v20.57,26.06 21.03,26.21 21.34,26.21 v27.28,32.16
N$29  (via drill 0.51)
  Top 0.203: v11.73,7.77 11.73,14.02 12.19,14.02 U$8.47 | v27.13,29.11 23.93,29.11 23.93,28.65 U$11.6
  Bottom 0.203: v27.13,29.11 30.02,29.11 30.02,15.39 22.71,8.08 22.71,4.32 12.7,4.32 12.7,6.6 11.68,6.6 11.68,7.77 v11.73,7.77
N$30
  Top 0.203: U$8.29 16.15,23.47 16.15,23.62 17.07,24.54 19.81,24.54 U$11.3
N$31
  Top 0.203: U$8.55 17.68,10.97 17.68,8.38 16,6.71 16,6.25 U$1.P$7
N$32
  Top 0.203: U$8.56 18.14,10.97 18.14,8.23 16.46,6.55 16.46,6.25 U$1.P$6
N$33
  Top 0.203: U$8.57 18.59,10.97 18.59,8.08 17.07,6.55 17.07,6.25 U$1.P$5
N$34
  Top 0.203: U$9.P$3 8.84,6.71 10.67,4.88 14.02,4.88 14.02,13.11 14.17,13.26 14.17,17.22 13.41,17.98 13.26,17.98 U$8.39
N$35
  Top 0.203: R3.2 28.5,19.51 27.13,18.14 27.13,17.83 26.98,17.68 25.45,17.68 25.45,18.44 24.84,19.05 24.69,19.05 U$8.12
N$37
  Top 0.203: U$12.P$1 29.72,21.18 29.87,21.03 29.87,20.12 R3.1
N$38
  Top 0.203: R5.2 26.06,19.51 24.69,19.51 U$8.13
N$39
  Top 0.203: U$14.P$1 29.11,22.4 27.13,20.42 27.13,19.05 26.82,18.75 R5.1
N$40
  Top 0.203: R7.2 25.3,23.01 23.77,21.49 23.16,21.49 23.16,20.27 23.32,20.12 23.62,20.12 U$8.14
N$41  (via drill 0.51)
  Top 0.203: v28.35,24.23 28.35,24.08 29.11,24.08 U$13.P$1 | v26.82,24.84 24.54,24.84 24.54,23.77 R7.1
  Bottom 0.203: v28.35,24.23 27.74,24.84 v26.82,24.84
N$42
  Top 0.203: R6.2 25.45,21.49 24.99,21.03 24.99,20.73 24.84,20.57 24.69,20.57 U$8.15
N$43
  Top 0.203: U$15.P$1 29.11,24.99 27.58,24.99 27.58,22.55 27.28,22.25 R6.1
VCC  (via drill 0.51)
  Top 0.203: TP5.TP 24.08,36.12 v21.95,36.12 19.66,36.12 19.66,37.03 19.36,37.34 17.98,37.34 17.98,36.88 C4.1 17.37,36.27 17.37,34.9 U$11.16 | U$9.P$8 6.1,16.46 C3.1 6.25,17.22 v6.25,18.14 | 28.8,16.46 28.8,17.22 C25.1 | 28.8,16.46 28.8,15.85 C24.1 | v24.84,12.65 24.84,13.26 24.69,13.41 U$8.1 | v28.04,16.46 28.8,16.46
  Bottom 0.203: U$2.15 26.06,21.03 25.76,21.03 U$2.14 25.6,21.34 25.6,21.64 | 25.6,21.64 25.6,23.01 C5.1 25.3,23.47 24.84,23.93 24.84,25.6 28.19,25.6 29.11,24.69 29.11,16.92 28.19,16.92 v28.04,16.46 | U$3.VDD_FSE 13.56,16.31 13.56,17.53 14.78,17.53 15.7,18.44 C17.1 15.7,18.9 15.24,18.9 15.24,20.42 15.39,20.57 19.36,20.57 20.42,21.64 25.6,21.64 | 8.23,12.95 7.77,12.5 C20.1 | 8.23,12.95 9.75,14.48 10.97,14.48 11.12,14.63 U$3.VCC | U$6.2 9.3,20.27 9.3,21.79 9.45,21.79 C19.1 9.45,22.4 9.3,22.55 v8.53,22.55 | R2.1 12.8,1.07 14.02,1.07 U$10.P$1-VOUT 14.94,1.07 v15.7,1.07 | U$3.VDDQ 12.5,12.34 v12.5,11.43 12.5,10.36 C21.1 | 12.5,17.37 12.5,18.44 C18.1 | 12.5,17.37 12.5,16.31 U$3.VCC_AGC | 16.15,15.09 17.07,15.09 C9.1 | 16.15,15.09 15.24,15.09 U$3.VDDN | C22.1 14.78,6.71 16.15,6.71 U$7.P$6_VDD 16.46,7.16 16.46,7.77 17.68,8.99 17.68,10.06 19.51,10.06 v20.88,8.69 | 16.15,15.09 v16.15,15.39 | 12.5,17.37 v11.43,17.37 | 8.23,12.95 6.4,14.78 6.4,17.68 v6.25,18.14
XOUT-MC  (via drill 0.51)
  Top 0.203: TP1.TP 7.01,4.42 19.66,4.42 19.66,10.97 U$8.59 19.66,12.04 19.66,12.5 v22.25,15.09
  Bottom 0.203: 22.71,20.27 21.95,20.27 C6.1 | 22.71,20.27 23.93,20.27 U$2.12 | 22.71,20.27 22.71,15.09 v22.25,15.09
YOUT-MC  (via drill 0.51)
  Top 0.203: TP2.TP 1.07,7.47 3.35,7.47 6.86,3.96 20.12,3.96 20.12,10.97 U$8.60 20.12,12.04 20.12,12.19 20.27,12.34 20.27,12.5 20.88,12.5 23.01,14.63 23.01,16 v21.49,16
  Bottom 0.203: U$2.10 23.93,18.9 23.77,18.9 23.16,18.29 23.16,14.33 21.79,14.33 21.49,14.63 v21.49,16 21.49,17.98 C7.1
ZOUT-MC  (via drill 0.51)
  Top 0.203: 23.93,7.32 23.93,1.07 19.81,1.07 19.66,1.22 19.66,1.83 15.24,1.83 14.94,1.52 14.94,1.07 9.14,1.07 5.49,4.72 1.07,4.72 TP3.TP | 23.93,7.32 23.93,7.47 20.73,10.67 20.73,10.97 U$8.61 | v26.06,14.48 26.21,14.33 26.21,9.6 23.93,7.32
  Bottom 0.203: U$2.8 24.99,17.37 24.99,15.39 C8.1 25.3,14.78 25.6,14.48 v26.06,14.48
(copper drawn outside any net)
  shapes: $gnd area x1, $vcc area x1

### Text on the board
tPlace: VCC | MEM | 15 | 31 | 14 | 13 | 32 | 12 | 33 | 34 | 35 | X | Y | Z
bPlace: University of Utah